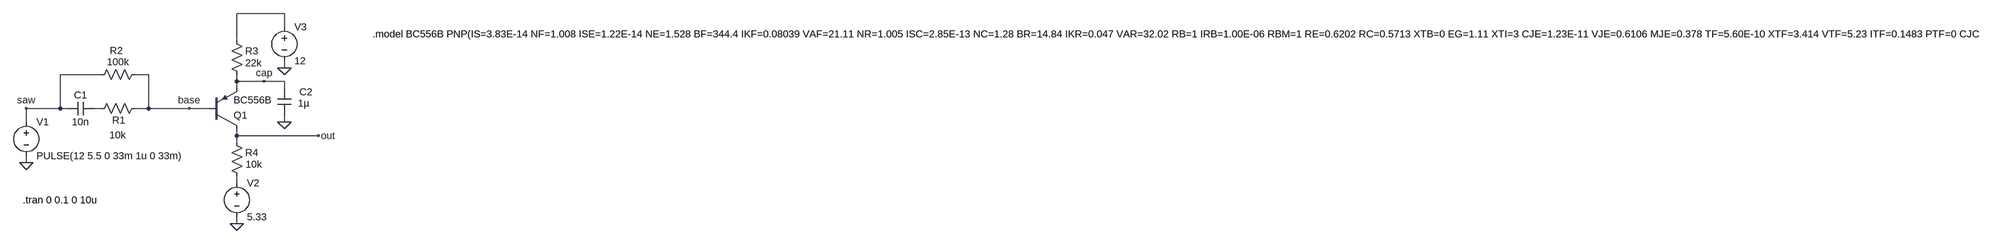
[diagram p0: schematic square.asc]
square.asc, the LTspice schematic file:
Version 4
SHEET 1 6592 680
WIRE 640 -128 528 -128
WIRE 640 -96 640 -128
WIRE 528 -64 528 -128
WIRE 640 0 640 -16
WIRE 208 16 112 16
WIRE 320 16 288 16
WIRE 528 32 528 16
WIRE 592 32 528 32
WIRE 640 32 592 32
WIRE 528 48 528 32
WIRE 640 48 640 32
WIRE 112 96 112 16
WIRE 112 96 32 96
WIRE 128 96 112 96
WIRE 208 96 192 96
WIRE 320 96 320 16
WIRE 320 96 288 96
WIRE 416 96 320 96
WIRE 464 96 416 96
WIRE 32 128 32 96
WIRE 640 128 640 112
WIRE 528 160 528 144
WIRE 720 160 528 160
WIRE 528 176 528 160
WIRE 32 224 32 208
WIRE 528 272 528 256
WIRE 528 368 528 352
FLAG 32 224 0
FLAG 640 128 0
FLAG 528 368 0
FLAG 640 0 0
FLAG 32 96 saw
FLAG 720 160 out
FLAG 592 32 cap
FLAG 416 96 base
SYMBOL voltage 32 112 R0
WINDOW 123 0 0 Left 0
WINDOW 39 0 0 Left 0
SYMATTR InstName V1
SYMATTR Value PULSE(12 5.5 0 33m 1u 0 33m)
SYMBOL res 304 80 R90
WINDOW 0 59 54 VBottom 2
WINDOW 3 63 57 VTop 2
SYMATTR InstName R1
SYMATTR Value 10k
SYMBOL res 304 0 R90
WINDOW 0 -25 60 VBottom 2
WINDOW 3 -29 56 VTop 2
SYMATTR InstName R2
SYMATTR Value 100k
SYMBOL cap 192 80 R90
WINDOW 0 0 32 VBottom 2
WINDOW 3 32 32 VTop 2
SYMATTR InstName C1
SYMATTR Value 10n
SYMBOL pnp 464 144 M180
SYMATTR InstName Q1
SYMATTR Value BC556B
SYMBOL res 512 -80 R0
WINDOW 3 36 69 Left 2
SYMATTR Value 22k
SYMATTR InstName R3
SYMBOL res 512 160 R0
WINDOW 3 37 68 Left 2
SYMATTR Value 10k
SYMATTR InstName R4
SYMBOL cap 624 48 R0
WINDOW 0 51 9 Left 2
WINDOW 3 48 36 Left 2
SYMATTR InstName C2
SYMATTR Value 1µ
SYMBOL voltage 528 256 R0
WINDOW 123 0 0 Left 0
WINDOW 39 0 0 Left 0
SYMATTR InstName V2
SYMATTR Value 5.33
SYMBOL voltage 640 -112 R0
WINDOW 123 0 0 Left 0
WINDOW 39 0 0 Left 0
SYMATTR InstName V3
SYMATTR Value 12
TEXT 24 312 Left 2 !.tran 0 0.1 0 10u
TEXT 848 -80 Left 2 !.model BC556B PNP(IS=3.83E-14 NF=1.008 ISE=1.22E-14 NE=1.528 BF=344.4 IKF=0.08039 VAF=21.11 NR=1.005 ISC=2.85E-13 NC=1.28 BR=14.84 IKR=0.047 VAR=32.02 RB=1 IRB=1.00E-06 RBM=1 RE=0.6202 RC=0.5713 XTB=0 EG=1.11 XTI=3 CJE=1.23E-11 VJE=0.6106 MJE=0.378 TF=5.60E-10 XTF=3.414 VTF=5.23 ITF=0.1483 PTF=0 CJC=1.08E-11 VJC=0.1022 MJC=0.3563 XCJC=0.6288 TR=1.00E-32 CJS=0 VJS=0.75 MJS=0.333 FC=0.8027 Vceo=65 Icrating=100m mfg=Philips)

The netlist it stands for:
* square.asc
V1 saw 0 PULSE(12 5.5 0 33m 1u 0 33m)
R1 base N002 10k
R2 base saw 100k
C1 N002 saw 10n
Q1 out base cap 0 BC556B
R3 N001 cap 22k
R4 out N003 10k
C2 cap 0 1µ
V2 N003 0 5.33
V3 N001 0 12
.model NPN NPN
.model PNP PNP
.lib standard.bjt
.tran 0 0.1 0 10u
.model BC556B PNP(IS=3.83E-14 NF=1.008 ISE=1.22E-14 NE=1.528 BF=344.4 IKF=0.08039 VAF=21.11 NR=1.005 ISC=2.85E-13 NC=1.28 BR=14.84 IKR=0.047 VAR=32.02 RB=1 IRB=1.00E-06 RBM=1 RE=0.6202 RC=0.5713 XTB=0 EG=1.11 XTI=3 CJE=1.23E-11 VJE=0.6106 MJE=0.378 TF=5.60E-10 XTF=3.414 VTF=5.23 ITF=0.1483 PTF=0 CJC=1.08E-11 VJC=0.1022 MJC=0.3563 XCJC=0.6288 TR=1.00E-32 CJS=0 VJS=0.75 MJS=0.333 FC=0.8027 Vceo=65 Icrating=100m mfg=Philips)
.backanno
.end